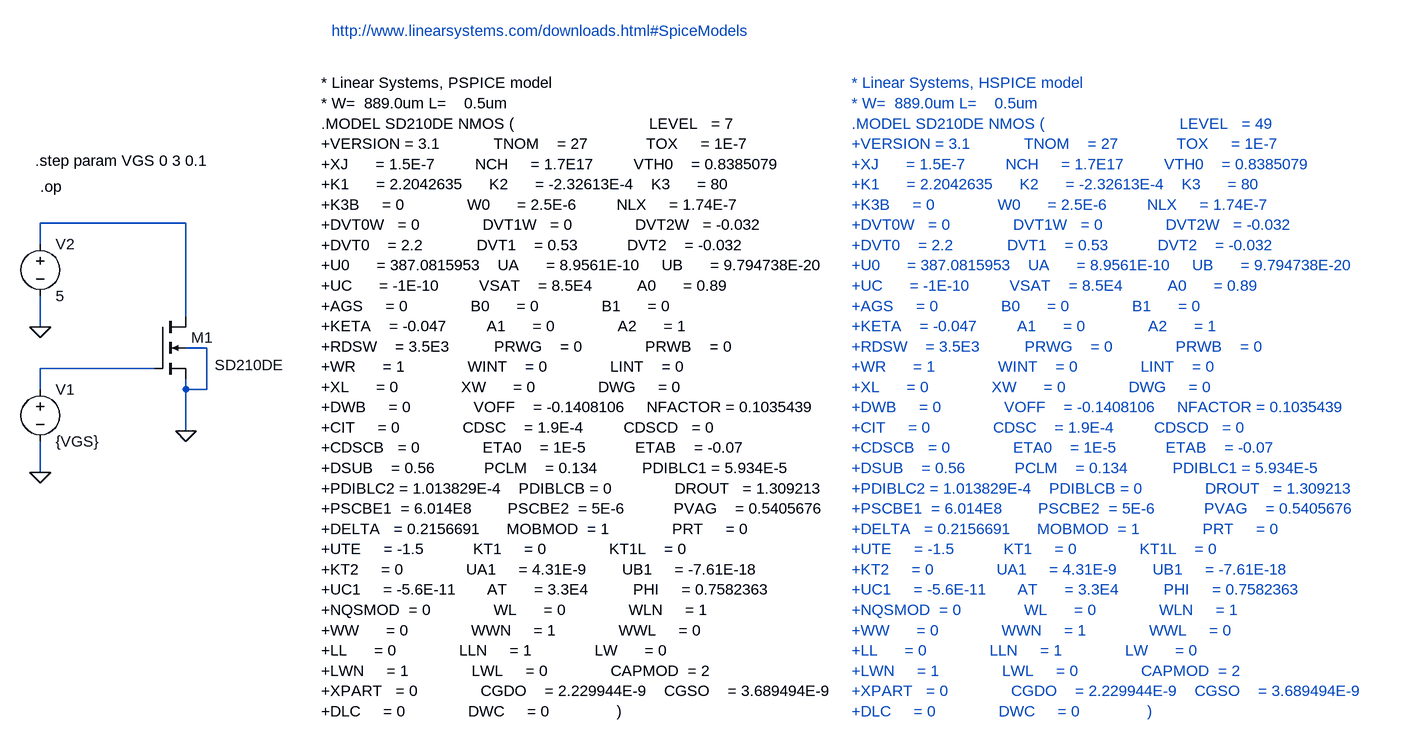
[diagram p0: schematic SD210_test.asc]
SD210_test.asc, the LTspice schematic file:
Version 4
SHEET 1 2140 896
WIRE 160 32 -64 32
WIRE -64 64 -64 32
WIRE 160 176 160 32
WIRE -64 192 -64 144
WIRE 192 224 160 224
WIRE 112 256 -64 256
WIRE -64 288 -64 256
WIRE 160 288 160 272
WIRE 192 288 192 224
WIRE 192 288 160 288
WIRE 160 352 160 288
WIRE -64 416 -64 368
FLAG 160 352 0
FLAG -64 416 0
FLAG -64 192 0
SYMBOL voltage -64 272 R0
SYMATTR InstName V1
SYMATTR Value {VGS}
SYMBOL voltage -64 48 R0
SYMATTR InstName V2
SYMATTR Value 5
SYMBOL nmos4 112 176 R0
WINDOW 3 92 74 Left 0
SYMATTR Value SD210DE
SYMATTR InstName M1
SYMATTR Value2 l=0.5u w=889u
TEXT 368 -184 Left 0 !* Linear Systems, PSPICE model\n* W=  889.0um L=    0.5um                                                           \n.MODEL SD210DE NMOS (                              LEVEL   = 7                  \n+VERSION = 3.1            TNOM    = 27             TOX     = 1E-7               \n+XJ      = 1.5E-7         NCH     = 1.7E17         VTH0    = 0.8385079          \n+K1      = 2.2042635      K2      = -2.32613E-4    K3      = 80                 \n+K3B     = 0              W0      = 2.5E-6         NLX     = 1.74E-7            \n+DVT0W   = 0              DVT1W   = 0              DVT2W   = -0.032             \n+DVT0    = 2.2            DVT1    = 0.53           DVT2    = -0.032             \n+U0      = 387.0815953    UA      = 8.9561E-10     UB      = 9.794738E-20       \n+UC      = -1E-10         VSAT    = 8.5E4          A0      = 0.89               \n+AGS     = 0              B0      = 0              B1      = 0                  \n+KETA    = -0.047         A1      = 0              A2      = 1                  \n+RDSW    = 3.5E3          PRWG    = 0              PRWB    = 0                  \n+WR      = 1              WINT    = 0              LINT    = 0                  \n+XL      = 0              XW      = 0              DWG     = 0                  \n+DWB     = 0              VOFF    = -0.1408106     NFACTOR = 0.1035439          \n+CIT     = 0              CDSC    = 1.9E-4         CDSCD   = 0                  \n+CDSCB   = 0              ETA0    = 1E-5           ETAB    = -0.07              \n+DSUB    = 0.56           PCLM    = 0.134          PDIBLC1 = 5.934E-5           \n+PDIBLC2 = 1.013829E-4    PDIBLCB = 0              DROUT   = 1.309213           \n+PSCBE1  = 6.014E8        PSCBE2  = 5E-6           PVAG    = 0.5405676          \n+DELTA   = 0.2156691      MOBMOD  = 1              PRT     = 0                  \n+UTE     = -1.5           KT1     = 0              KT1L    = 0                  \n+KT2     = 0              UA1     = 4.31E-9        UB1     = -7.61E-18          \n+UC1     = -5.6E-11       AT      = 3.3E4          PHI     = 0.7582363          \n+NQSMOD  = 0              WL      = 0              WLN     = 1                  \n+WW      = 0              WWN     = 1              WWL     = 0                  \n+LL      = 0              LLN     = 1              LW      = 0                  \n+LWN     = 1              LWL     = 0              CAPMOD  = 2                  \n+XPART   = 0              CGDO    = 2.229944E-9    CGSO    = 3.689494E-9        \n+DLC     = 0              DWC     = 0               )
TEXT -72 -64 Left 0 !.step param VGS 0 3 0.1
TEXT -64 -24 Left 0 !.op
TEXT 1184 -184 Left 0 ;* Linear Systems, HSPICE model\n* W=  889.0um L=    0.5um                                                           \n.MODEL SD210DE NMOS (                              LEVEL   = 49                  \n+VERSION = 3.1            TNOM    = 27             TOX     = 1E-7               \n+XJ      = 1.5E-7         NCH     = 1.7E17         VTH0    = 0.8385079          \n+K1      = 2.2042635      K2      = -2.32613E-4    K3      = 80                 \n+K3B     = 0              W0      = 2.5E-6         NLX     = 1.74E-7            \n+DVT0W   = 0              DVT1W   = 0              DVT2W   = -0.032             \n+DVT0    = 2.2            DVT1    = 0.53           DVT2    = -0.032             \n+U0      = 387.0815953    UA      = 8.9561E-10     UB      = 9.794738E-20       \n+UC      = -1E-10         VSAT    = 8.5E4          A0      = 0.89               \n+AGS     = 0              B0      = 0              B1      = 0                  \n+KETA    = -0.047         A1      = 0              A2      = 1                  \n+RDSW    = 3.5E3          PRWG    = 0              PRWB    = 0                  \n+WR      = 1              WINT    = 0              LINT    = 0                  \n+XL      = 0              XW      = 0              DWG     = 0                  \n+DWB     = 0              VOFF    = -0.1408106     NFACTOR = 0.1035439          \n+CIT     = 0              CDSC    = 1.9E-4         CDSCD   = 0                  \n+CDSCB   = 0              ETA0    = 1E-5           ETAB    = -0.07              \n+DSUB    = 0.56           PCLM    = 0.134          PDIBLC1 = 5.934E-5           \n+PDIBLC2 = 1.013829E-4    PDIBLCB = 0              DROUT   = 1.309213           \n+PSCBE1  = 6.014E8        PSCBE2  = 5E-6           PVAG    = 0.5405676          \n+DELTA   = 0.2156691      MOBMOD  = 1              PRT     = 0                  \n+UTE     = -1.5           KT1     = 0              KT1L    = 0                  \n+KT2     = 0              UA1     = 4.31E-9        UB1     = -7.61E-18          \n+UC1     = -5.6E-11       AT      = 3.3E4          PHI     = 0.7582363          \n+NQSMOD  = 0              WL      = 0              WLN     = 1                  \n+WW      = 0              WWN     = 1              WWL     = 0                  \n+LL      = 0              LLN     = 1              LW      = 0                  \n+LWN     = 1              LWL     = 0              CAPMOD  = 2                  \n+XPART   = 0              CGDO    = 2.229944E-9    CGSO    = 3.689494E-9        \n+DLC     = 0              DWC     = 0               )
TEXT 384 -264 Left 0 ;http://www.linearsystems.com/downloads.html#SpiceModels

The netlist it stands for:
* SD210_test.asc
V1 N002 0 {VGS}
V2 N001 0 5
M1 N001 N002 0 0 SD210DE l=0.5u w=889u
.model NMOS NMOS
.model PMOS PMOS
.lib standard.mos
* Linear Systems, PSPICE model
* W=  889.0um L=    0.5um
.MODEL SD210DE NMOS (                              LEVEL   = 7
+VERSION = 3.1            TNOM    = 27             TOX     = 1E-7
+XJ      = 1.5E-7         NCH     = 1.7E17         VTH0    = 0.8385079
+K1      = 2.2042635      K2      = -2.32613E-4    K3      = 80
+K3B     = 0              W0      = 2.5E-6         NLX     = 1.74E-7
+DVT0W   = 0              DVT1W   = 0              DVT2W   = -0.032
+DVT0    = 2.2            DVT1    = 0.53           DVT2    = -0.032
+U0      = 387.0815953    UA      = 8.9561E-10     UB      = 9.794738E-20
+UC      = -1E-10         VSAT    = 8.5E4          A0      = 0.89
+AGS     = 0              B0      = 0              B1      = 0
+KETA    = -0.047         A1      = 0              A2      = 1
+RDSW    = 3.5E3          PRWG    = 0              PRWB    = 0
+WR      = 1              WINT    = 0              LINT    = 0
+XL      = 0              XW      = 0              DWG     = 0
+DWB     = 0              VOFF    = -0.1408106     NFACTOR = 0.1035439
+CIT     = 0              CDSC    = 1.9E-4         CDSCD   = 0
+CDSCB   = 0              ETA0    = 1E-5           ETAB    = -0.07
+DSUB    = 0.56           PCLM    = 0.134          PDIBLC1 = 5.934E-5
+PDIBLC2 = 1.013829E-4    PDIBLCB = 0              DROUT   = 1.309213
+PSCBE1  = 6.014E8        PSCBE2  = 5E-6           PVAG    = 0.5405676
+DELTA   = 0.2156691      MOBMOD  = 1              PRT     = 0
+UTE     = -1.5           KT1     = 0              KT1L    = 0
+KT2     = 0              UA1     = 4.31E-9        UB1     = -7.61E-18
+UC1     = -5.6E-11       AT      = 3.3E4          PHI     = 0.7582363
+NQSMOD  = 0              WL      = 0              WLN     = 1
+WW      = 0              WWN     = 1              WWL     = 0
+LL      = 0              LLN     = 1              LW      = 0
+LWN     = 1              LWL     = 0              CAPMOD  = 2
+XPART   = 0              CGDO    = 2.229944E-9    CGSO    = 3.689494E-9
+DLC     = 0              DWC     = 0               )
.step param VGS 0 3 0.1
.op
* * Linear Systems, HSPICE model
* * W=  889.0um L=    0.5um
* .MODEL SD210DE NMOS (                              LEVEL   = 49
* +VERSION = 3.1            TNOM    = 27             TOX     = 1E-7
* +XJ      = 1.5E-7         NCH     = 1.7E17         VTH0    = 0.8385079
* +K1      = 2.2042635      K2      = -2.32613E-4    K3      = 80
* +K3B     = 0              W0      = 2.5E-6         NLX     = 1.74E-7
* +DVT0W   = 0              DVT1W   = 0              DVT2W   = -0.032
* +DVT0    = 2.2            DVT1    = 0.53           DVT2    = -0.032
* +U0      = 387.0815953    UA      = 8.9561E-10     UB      = 9.794738E-20
* +UC      = -1E-10         VSAT    = 8.5E4          A0      = 0.89
* +AGS     = 0              B0      = 0              B1      = 0
* +KETA    = -0.047         A1      = 0              A2      = 1
* +RDSW    = 3.5E3          PRWG    = 0              PRWB    = 0
* +WR      = 1              WINT    = 0              LINT    = 0
* +XL      = 0              XW      = 0              DWG     = 0
* +DWB     = 0              VOFF    = -0.1408106     NFACTOR = 0.1035439
* +CIT     = 0              CDSC    = 1.9E-4         CDSCD   = 0
* +CDSCB   = 0              ETA0    = 1E-5           ETAB    = -0.07
* +DSUB    = 0.56           PCLM    = 0.134          PDIBLC1 = 5.934E-5
* +PDIBLC2 = 1.013829E-4    PDIBLCB = 0              DROUT   = 1.309213
* +PSCBE1  = 6.014E8        PSCBE2  = 5E-6           PVAG    = 0.5405676
* +DELTA   = 0.2156691      MOBMOD  = 1              PRT     = 0
* +UTE     = -1.5           KT1     = 0              KT1L    = 0
* +KT2     = 0              UA1     = 4.31E-9        UB1     = -7.61E-18
* +UC1     = -5.6E-11       AT      = 3.3E4          PHI     = 0.7582363
* +NQSMOD  = 0              WL      = 0              WLN     = 1
* +WW      = 0              WWN     = 1              WWL     = 0
* +LL      = 0              LLN     = 1              LW      = 0
* +LWN     = 1              LWL     = 0              CAPMOD  = 2
* +XPART   = 0              CGDO    = 2.229944E-9    CGSO    = 3.689494E-9
* +DLC     = 0              DWC     = 0               )
* http://www.linearsystems.com/downloads.html#SpiceModels
.backanno
.end